# Altium schematic sheet PROC054D_System_3V3_Supply.SchDoc: System_3V3_Supply
size 558 x 431 mm; Date: Not shown in title block; ApprovedBy: Not shown in title block; CheckedBy: Not shown in title block; Author: Not shown in title block; CompanyName: Not shown in title block; DrawnBy: a0271760; Engineer: Not shown in title block; Organization: Not shown in title block; Address1: Not shown in title block; Address2: Not shown in title block; Address3: Not shown in title block; Address4: Not shown in title block; DocumentNumber: 8; Revision: Use project pAWRameter SCH_Rev; SheetNumber: 8; SheetTotal: 19; PageSetup: Record=PageOptions|CenterHorizontal=True|CenterVertical=True|PrintScale=1.00|XCorrection=1.00|YCorrection=1.00|PrintKind=0|BorderSize=5000000|LeftOffset=0|BottomOffset=0|Orientation=2|PaperLength=1000|PaperWidth=1000|Scale=100|PaperSource=15|PrintQuality=600|MediaType=1|DitherType=10|PaperKind=Letter|PrintScaleMode=1; CurrentTime: Not shown in title block; CurrentDate: Not shown in title block; Time: Not shown in title block; DocumentFullPathAndName: Not shown in title block; DocumentName: Not shown in title block; ModifiedDate: Not shown in title block; ImagePath: Not shown in title block
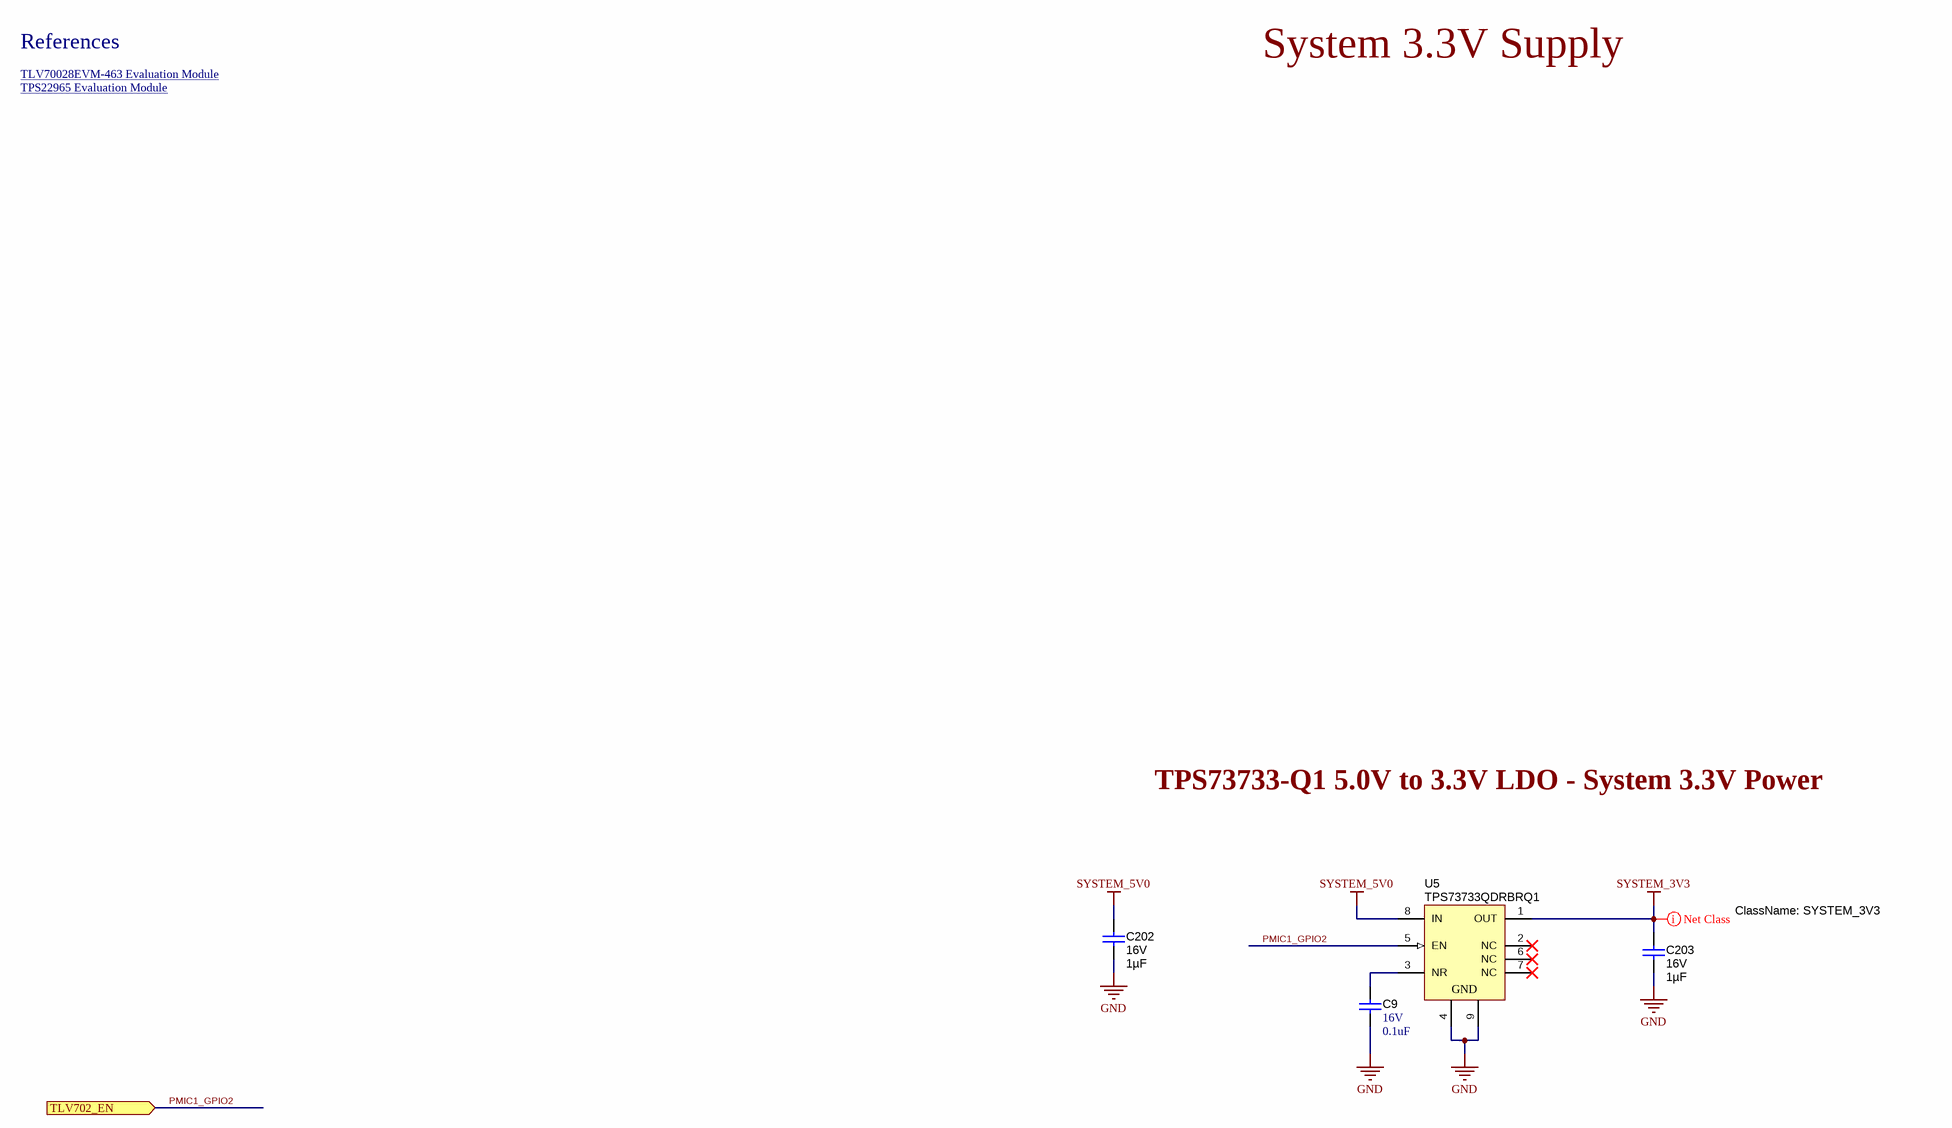
[diagram p0: PROC054D_System_3V3_Supply.SchDoc]

## Parts
C9  VDC_V: 16V  ValueDisplayed: 0.1uF  [0402]  (hidden comment: GCM155R71C104KA55D)
C202  VDC_V: 16V  ValueDisplayed: 1µF  [0603]  (hidden comment: GCM188R71C105KA64J)
C203  VDC_V: 16V  ValueDisplayed: 1µF  [0603]  (hidden comment: GCM188R71C105KA64J)
U5  TPS73733QDRBRQ1  [DRB0008A]

## Ports
TLV702_EN (in)

## Nets
GND: C9.2 C202.2 C203.2 U5.4(GND) U5.9(GND)
SYSTEM_3V3: C203.1 U5.1(OUT)
SYSTEM_5V0: C202.1 U5.8(IN)
PMIC1_GPIO2: U5.5(EN) ; port TLV702_EN
NetC9_1: C9.1 U5.3(NR)

Not connected (* = marked no-connect by the designer): U5 2(NC)* 6(NC)* 7(NC)*

## Layout directives
net class SYSTEM_3V3: SYSTEM_3V3

## Notes on the sheet
- References
- System 3.3V Supply
- TLV70028EVM-463 Evaluation Module <http://www.ti.com/tool/tlv70028evm-463>
- TPS22965 Evaluation Module <http://www.ti.com/tool/tps22965evm-023>
- TPS73733-Q1 5.0V to 3.3V LDO - System 3.3V Power
- Drawn By:
- SVN Rev:
- Number:
- TID #:
- Orderable:
- Rev:
- Sheet Title:
- File:
- Project Title:
- Designed for:
- Assembly VAWRiant:
- Mod. Date:
- Sheet:
- Size:
- of
- C
- http://www.ti.com
- Texas Instruments and/or its licensors do not wAWRrant the accuracy or completeness of this specification or any information contained therein. Texas Instruments and/or its licensors do not wAWRrant that this design will meet the specifications, will be suitable for your application or fit for any pAWRticulAWR purpose, or will operate in an implementation. Texas Instruments and/or its licensors do not wAWRrant that the design is production worthy. You should completely validate and test your design implementation to confirm the system functionality for your application.
- Engineer:
- Contact:
- © Texas Instruments

## Library data of the parts
C9 = CMP-0006351-2: CAP, CERM, 0.1 uF, 16 V, +/- 10%, X7R, 0402; Manufacturer: MuRata; TaMin_C: -55°C; Polarized: N; SizeAreaWB_mm2: 3; Value1: Unknown; U/M: EA; Value: 0.1uF; TaMax_C: 125°C; SizeZ_mm: 0.6; SizeX_mm: 1; SizeY_mm: 0.5; Cap_F: 100nF; AEC Category: Q200; Publisher: Texas Instruments; TempCo: X7R; Published: 2008-06-19; RoHS: Y; MountType: SMT; Supplier 1: Digi-Key; PackageReference: 0402; Tolerance_%: 10%; Cap_Case: 0402; Value2: 16V; SizeArea_mm2: 0.5; CompType: Capacitor; LatestRevisionDate: 2017-03-09; PartNumber: GCM155R71C104KA55D; AEC Qualified: ?; ComponentLink1Description: Datasheet link; Supplier Part Number 1: 490-4759-2-ND; Technology: Ceramic; ComponentLink1URL: http://psearch.murata.com/capacitor/product/GCM155R71C104KA55%23.pdf
C202 C203 = CMP-0079154-1: CAP, CERM, 1 µF, 16 V,+/- 10%, X7R, AEC-Q200 Grade 1, 0603; Manufacturer: MuRata; SizeAreaWB_mm2: 4.68; SizeArea_mm2: 1.28; AEC Qualified: Y; AEC Category: Q200; Value: 1uF; TaMax_C: 125°C; SizeZ_mm: 1; Polarized: N; TaMin_C: -55°C; SizeY_mm: 0.8; U/M: EA; SizeX_mm: 1.6; ComponentLink1Description: Datasheet link; Cap_F: 1µF; RoHS: Y; Tolerance_%: 10%; Supplier 1: Digi-Key; PackageReference: 0603; Technology: Ceramic; PartNumber: GCM188R71C105KA64J; TempCo: X7R; Supplier Part Number 2: 81-GCM188R71C105KA4J; Supplier 2: Mouser; AEC Grade: 1; Value2: 16V; ComponentLink1URL: https://www.murata.com/~/media/webrenewal/support/library/catalog/products/capacitor/mlcc/c03e.ashx; CompType: Capacitor; MountType: SMT; Supplier Part Number 1: 490-12657-1-ND; Cap_Case: 0603
U5 = CMP-0036354-2: Single Output Automotive LDO, 1 A, Fixed 3.3 V Output, 2.2 to 5.5 V Input, with Reverse Current Protection, 8-pin SON (DRB), -40 to 125 degC, Green (RoHS & no Sb/Br); Manufacturer: Texas Instruments; Vin(Min)(V): 2.2; Vout Adj(Max)(V): 3.3; Vin(Max)(V): 5.5; Accuracy(%): 3; SubFamily: Single Channel LDO; Iq(Typ)(mA): 0.3; Vdo(Typ)(mV): 130; Iout(Max)(A): 1; ComponentLink1URL: http://www.ti.com/; Fixed Output Options(V): 3.3; PackageDescription: 8-Pin Plastic Small Outline, Body 3 x 3 mm, Pitch 0.65 mm; ComponentLink2URL: http://www.ti.com/general/docs/lit/getliterature.tsp?genericPartNumber=TPS73733-Q1&fileType=pdf; ComponentLink3Description: Package Specification; Eco-Plan: Green (RoHS & no Sb/Br); ComponentLink2Description: Datasheet; Vout Adj(Min)(V): 3.3; Rating: Automotive; ComponentLink3URL: http://www.ti.com/litv/pdf/mpds118h; PackageReference: DRB0008A; DatasheetVersion: SBVS123; PartNumber: TPS73733QDRBRQ1; PackageVersion: 4203482-2/K; Mounting Technology: Surface Mount; ComponentLink1Description: Manufacturer URL